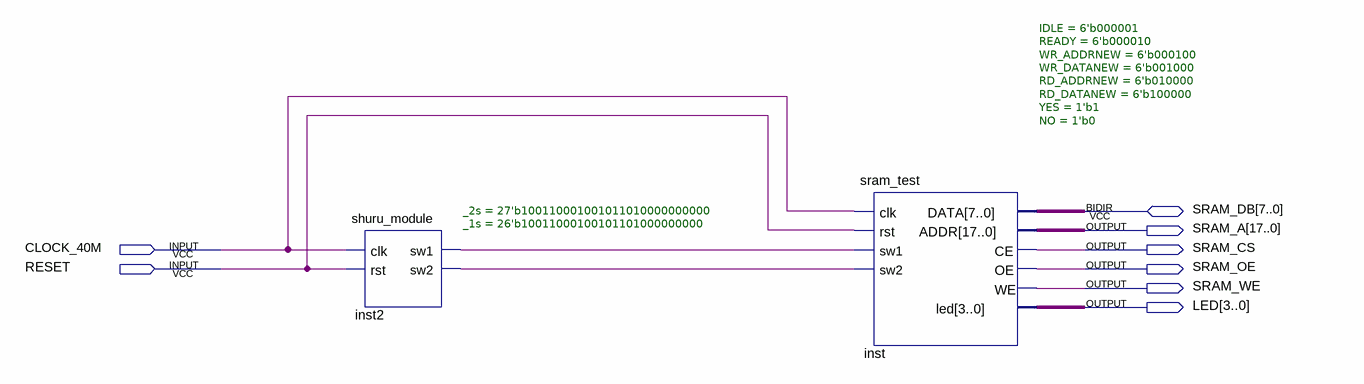
[diagram p0: schematic sheet]
// Quartus schematic SRAM_LED_test.bdf as structural Verilog: 2 symbols, 8 pins
module SRAM_LED_test (
  input  CLOCK_40M,
  input  RESET,
  inout  [7:0] SRAM_DB,
  output [17:0] SRAM_A,
  output SRAM_CS,
  output SRAM_OE,
  output SRAM_WE,
  output [3:0] LED
);

  wire inst2_sw1, inst2_sw2;

  shuru_module #(._2s(27'b100110001001011010000000000), ._1s(26'b10011000100101101000000000)) inst2 (
    .clk(CLOCK_40M), .rst(RESET), .sw1(inst2_sw1), .sw2(inst2_sw2));
  sram_test #(.IDLE(6'b000001), .READY(6'b000010), .WR_ADDRNEW(6'b000100), .WR_DATANEW(6'b001000), .RD_ADDRNEW(6'b010000), .RD_DATANEW(6'b100000), .YES(1'b1), .NO(1'b0)) inst (
    .clk(CLOCK_40M), .rst(RESET), .sw1(inst2_sw1), .sw2(inst2_sw2), .ADDR(SRAM_A), .CE(SRAM_CS),
    .OE(SRAM_OE), .WE(SRAM_WE), .led(LED), .DATA(SRAM_DB));
endmodule
